# EAGLE design hotend-connector (EAGLE 5.11)
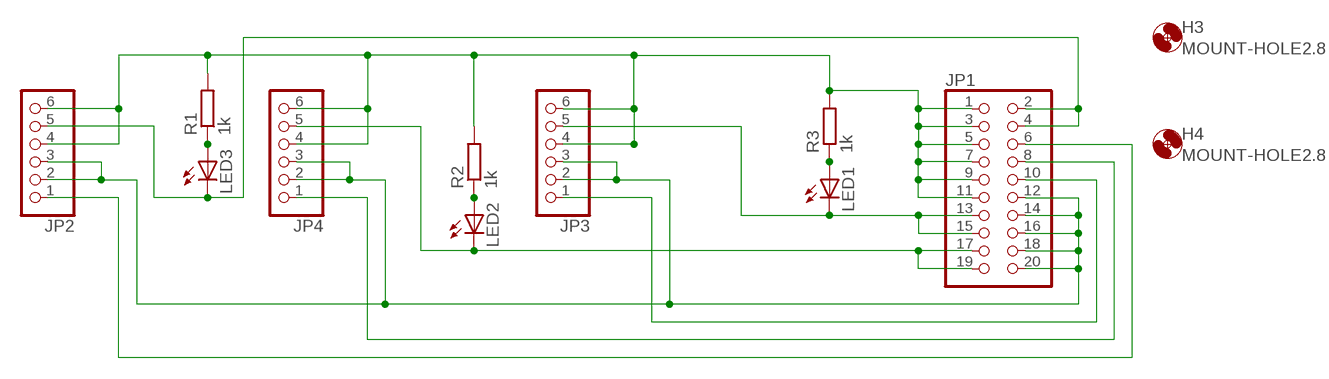
[diagram p0: schematic, sheet 1]

## Parts
H3  MOUNT-HOLE2.8  [2,8]
H4  MOUNT-HOLE2.8  [2,8]
JP1  PINHD-2X10  [2X10]
JP2  PINHD-1X6  [1X06]
JP3  PINHD-1X6  [1X06]
JP4  PINHD-1X6  [1X06]
LED1  LED3MM  [LED3MM]
LED2  LED3MM  [LED3MM]
LED3  LED3MM  [LED3MM]
R1  1k  R-EU_0204/5  [0204/5]
R2  1k  R-EU_0204/5  [0204/5]
R3  1k  R-EU_0204/5  [0204/5]

## Nets
N$1: JP1.13 JP1.15 JP3.5 LED1.K(C)
N$2: JP1.17 JP1.19 JP4.5 LED2.K(C)
N$4: LED3.A R1.1
N$5: JP1.12 JP1.14 JP1.16 JP1.18 JP1.20 JP2.2 JP2.3 JP3.2 JP3.3 JP4.2 JP4.3
N$6: LED2.A R2.1
N$8: JP1.2 JP1.4 JP2.5 LED3.K(C)
N$9: LED1.A R3.1
N$10: JP1.1 JP1.3 JP1.5 JP1.7 JP1.9 JP1.11 JP2.4 JP2.6 JP3.4 JP3.6 JP4.4 JP4.6 R1.2 R2.2 R3.2
N$12: JP1.10 JP3.1
N$13: JP1.8 JP4.1
N$14: JP1.6 JP2.1

## Library data of the parts
H3 H4 = holes:MOUNT-HOLE: MOUNTING HOLE with drill center marker
JP1 = pinhead:PINHD-2X10: PIN HEADER
JP2-JP4 = pinhead:PINHD-1X6: PIN HEADER
LED1-LED3 = led:LED: LED OSRAM: - CHIPLED LG R971, LG N971, LY N971, LG Q971, LY Q971, LO R971, LY R971 LH N974, LH R974 LS Q976, LO Q976, LY Q976 LO Q996 - Hyper CHIPLED LW Q18S LB Q993, LB Q99A, LB R99A - SideLED LS A670, LO A670, LY A670, LG A670, LP A670 LB A673, LV A673, LT A673, LW A673 LH A674 LY A675 LS A676, LA A676, LO A676, LY A676, LW A676 LS A679, LY A679, LG A679 - Hyper Micro SIDELED® LS Y876, LA Y876, LO Y876, LY Y876 LT Y87S - SmartLED LW L88C, LW L88S LB L89C, LB L89S, LG L890 LS L89K, LO L89K, LY L89K LS L896, LA L896, LO L896, LY L896 - TOPLED LS T670, LO T670, LY T670, LG T670, LP T670 LSG T670, LSP T670, LSY T670, LOP T670, LYG T670 LG T671, LOG T671, LSG T671 LB T673, LV T673, LT T673, LW T673 LH T674 LS T676, LA T676, LO T676, LY T676, LB T676, LH T676, LSB T676, LW T676 LB T67C, LV T67C, LT T67C, LS T67K, LO T67K, LY T67K, LW E67C LS E67B, LA E67B, LO E67B, LY E67B, LB E67C, LV E67C, LT E67C LW T67C LS T679, LY T679, LG T679 LS T770, LO T770, LY T770, LG T770, LP T770 LB T773, LV T773, LT T773, LW T773 LH T774 LS E675, LA E675, LY E675, LS T675 LS T776, LA T776, LO T776, LY T776, LB T776 LHGB T686 LT T68C, LB T68C - Hyper Mini TOPLED® LB M676 - Mini TOPLED Santana® LG M470 LS M47K, LO M47K, LY M47K Source: http://www.osram.convergy.de LUXEON: - LUMILED® LXK2-PW12-R00, LXK2-PW12-S00, LXK2-PW14-U00, LXK2-PW14-V00 LXK2-PM12-R00, LXK2-PM12-S00, LXK2-PM14-U00 LXK2-PE12-Q00, LXK2-PE12-R00, LXK2-PE12-S00, LXK2-PE14-T00, LXK2-PE14-U00 LXK2-PB12-K00, LXK2-PB12-L00, LXK2-PB12-M00, LXK2-PB14-N00, LXK2-PB14-P00, LXK2-PB14-Q00 LXK2-PR12-L00, LXK2-PR12-M00, LXK2-PR14-Q00, LXK2-PR14-R00 LXK2-PD12-Q00, LXK2-PD12-R00, LXK2-PD12-S00 LXK2-PH12-R00, LXK2-PH12-S00 LXK2-PL12-P00, LXK2-PL12-Q00, LXK2-PL12-R00 Source: www.luxeon.com KINGBRIGHT: KA-3528ASYC Source: www.kingbright.com
R1-R3 = rcl:R-EU_: RESISTOR, European symbol

## Board
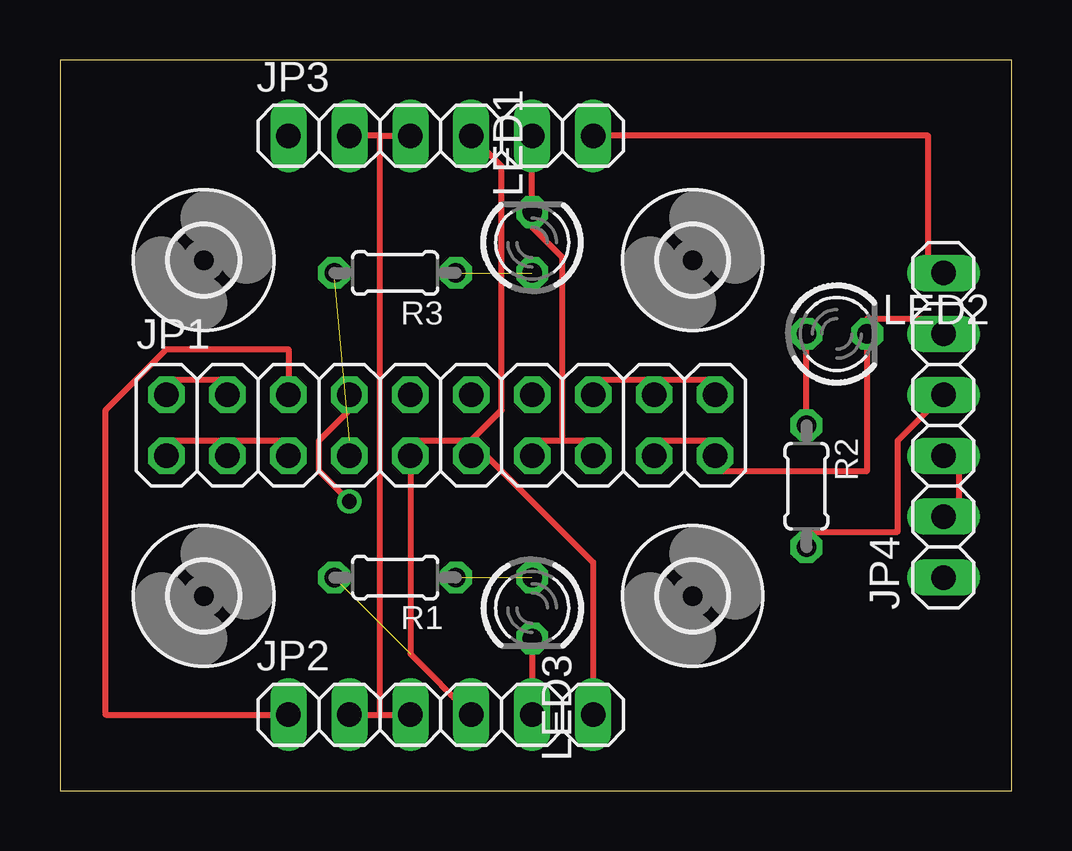
[diagram p1: board, top side]
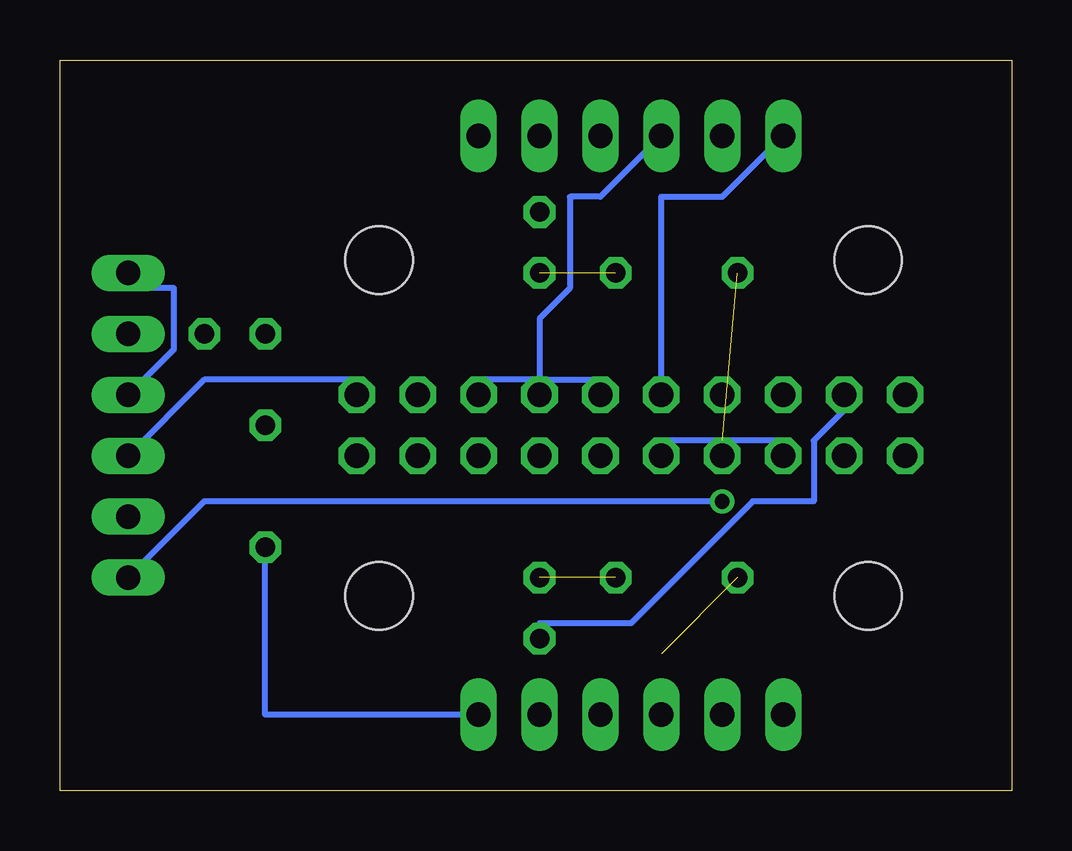
[diagram p2: board, bottom side, seen from below]

Size 39.67 x 30.47 mm. Coordinates in mm from the lower left corner, seen from the top.
Outline: 0,0 39.67,0 39.67,30.47 0,30.47 0,0
Copper layers (1*16): Top 0.035mm / dielectric 1.5mm / Bottom 0.035mm
Design rules "default": minimum track width 10mil, minimum drill 24mil, track to track 8mil, track to pad 8mil, pad to pad 8mil, via to via 8mil, smd to smd 8mil, copper to edge 40mil, drill to drill 8mil, minimum pad ring 10mil, minimum via ring 8mil, stop-mask expansion 4mil, vias tented up to drill 0mil, thermal gap 10mil

### Footprints (pad centres in the part's own frame; a part is rotated, then mirrored left to right if it is on the bottom)
2,8 = hole 2.8: 0,0
2X10 = drill 1.016 octagon: 1 -11.43,-1.27; 2 -11.43,1.27; 3 -8.89,-1.27; 4 -8.89,1.27; 5 -6.35,-1.27; 6 -6.35,1.27; 7 -3.81,-1.27; 8 -3.81,1.27; 9 -1.27,-1.27; 10 -1.27,1.27; 11 1.27,-1.27; 12 1.27,1.27; 13 3.81,-1.27; 14 3.81,1.27; 15 6.35,-1.27; 16 6.35,1.27; 17 8.89,-1.27; 18 8.89,1.27; 19 11.43,-1.27; 20 11.43,1.27
1X06 = drill 1.016 long: 1 -6.35,0; 2 -3.81,0; 3 -1.27,0; 4 1.27,0; 5 3.81,0; 6 6.35,0
LED3MM = drill 0.813 octagon: A -1.27,0; K 1.27,0
0204/5 = drill 0.813 octagon: 1 -2.54,0; 2 2.54,0

### Placement (x,y rotation side)
H1  MOUNT-HOLE2.8  [2,8]  5.99,22.13 0 top
H2  MOUNT-HOLE2.8  [2,8]  26.37,22.13 0 top
H3  5.99,8.13 0 top
H4  26.37,8.13 0 top
JP1  15.87,15.24 0 top
JP2  15.87,3.18 0 top
JP3  15.87,27.31 0 top
JP4  36.83,15.24 90 top
LED1  19.68,22.86 90 top
LED2  32.39,19.05 0 top
LED3  19.68,7.62 270 top
R1  13.97,8.89 180 top
R2  31.11,12.7 270 top
R3  13.97,21.59 180 top

### Tracks (layer width: path | path; a pad name or v marks a point on that pad's centre or on a via)
N$1
  Top 0.254: 20.96,14.61 22.22,14.61 JP1.15 | 20.96,14.61 19.68,14.61 JP1.13 | JP3.5 LED1.K 19.68,23.5 20.96,22.22 20.96,14.61
N$2
  Top 0.254: JP1.17 24.76,14.61 27.3,14.61 JP1.19 27.3,13.33 33.66,13.33 LED2.K 33.66,19.68 36.19,19.68 JP4.5
N$4  (1 unrouted)
N$5
  Top 0.254: JP4.2 37.47,12.07 37.47,13.33 JP4.3 | 24.76,17.14 22.22,17.14 JP1.16 | 24.76,17.14 27.3,17.14 JP1.20 | 24.76,17.14 JP1.18 | 13.33,3.18 JP2.3 | JP2.2 13.33,3.18 | 13.33,27.31 JP3.3 | 13.33,27.31 JP3.2 | 13.33,3.18 13.33,27.31
  Bottom 0.254: 19.68,17.14 17.14,17.14 JP1.12 | 19.68,17.14 22.22,17.14 JP1.16 | JP4.3 33.66,17.14 27.3,17.14 JP1.20 | 19.68,17.14 19.68,19.68 18.41,20.96 18.41,24.77 17.14,24.77 JP3.3 | 19.68,17.14 JP1.14
N$6
  Top 0.254: R2.1 LED2.A
N$8
  Top 0.254: JP1.2 4.45,17.14 6.98,17.14 JP1.4 | LED3.K JP2.5
  Bottom 0.254: JP1.4 6.98,15.88 8.25,14.61 8.25,12.07 10.79,12.07 15.87,6.99 19.68,6.99 LED3.K
N$9  (1 unrouted)
N$10  (2 unrouted)
  Top 0.254: 6.98,14.61 4.45,14.61 JP1.1 | 6.98,14.61 9.53,14.61 JP1.5 | 6.98,14.61 JP1.3 | 17.14,14.61 14.61,14.61 JP1.9 14.61,5.71 JP2.4 | JP3.4 18.41,26.04 18.41,15.88 17.14,14.61 | JP3.6 36.19,27.31 36.19,22.22 JP4.6 | R2.2 31.11,10.79 34.92,10.79 34.92,14.61 JP4.4 | 17.14,14.61 22.22,9.53 JP2.6 | 17.14,14.61 JP1.11
  Bottom 0.254: 12.07,14.61 9.53,14.61 JP1.5 | 12.07,14.61 14.61,14.61 JP1.9 | 12.07,14.61 JP1.7 | JP2.6 31.11,3.18 R2.2 | JP4.4 34.92,18.42 34.92,20.96 36.19,20.96 JP4.6
N$12
  Bottom 0.254: JP3.1 12.07,24.77 14.61,24.77 JP1.10
N$13  (via drill 0.61)
  Top 0.254: v12.07,12.07 10.79,13.33 10.79,14.61 12.07,15.88 JP1.8
  Bottom 0.254: v12.07,12.07 33.66,12.07 JP4.1
N$14
  Top 0.254: JP2.1 1.9,3.18 1.9,15.88 4.45,18.42 9.53,18.42 JP1.6